# EAGLE design cbr250r_license_light (EAGLE 6.6.0)
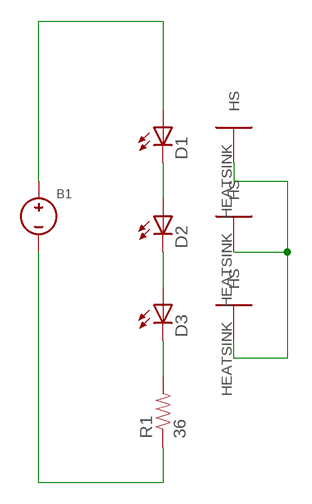
[diagram p0: schematic, sheet 1]

## Parts
B1  168_BULBLIGHT_DOWN  [168_BULB]
D1  LED_HEATSINK4-SMD  [4-SMD]
D2  LED_HEATSINK4-SMD  [4-SMD]
D3  LED_HEATSINK4-SMD  [4-SMD]
R1  36  RESISTOR2010  [R2010]

## Nets
GND: B1.2A(-) B1.2B(-) R1.1
HEATSINK: D1.HEATSINK(HS) D2.HEATSINK(HS) D3.HEATSINK(HS)
N$2: D1.CAT1(C) D1.CAT2(C) D2.ANO1(A) D2.ANO2(A)
N$3: D2.CAT1(C) D2.CAT2(C) D3.ANO1(A) D3.ANO2(A)
N$4: D3.CAT1(C) D3.CAT2(C) R1.2
VDD: B1.1A(+) B1.1B(+) D1.ANO1(A) D1.ANO2(A)

## Library data of the parts
B1 = my_parts:168_BULB
D1-D3 = my_parts:LED_HEATSINK
R1 = SparkFun-Passives:RESISTOR: Resistor Basic schematic elements and footprints for 0603, 1206, and PTH resistors.

## Board
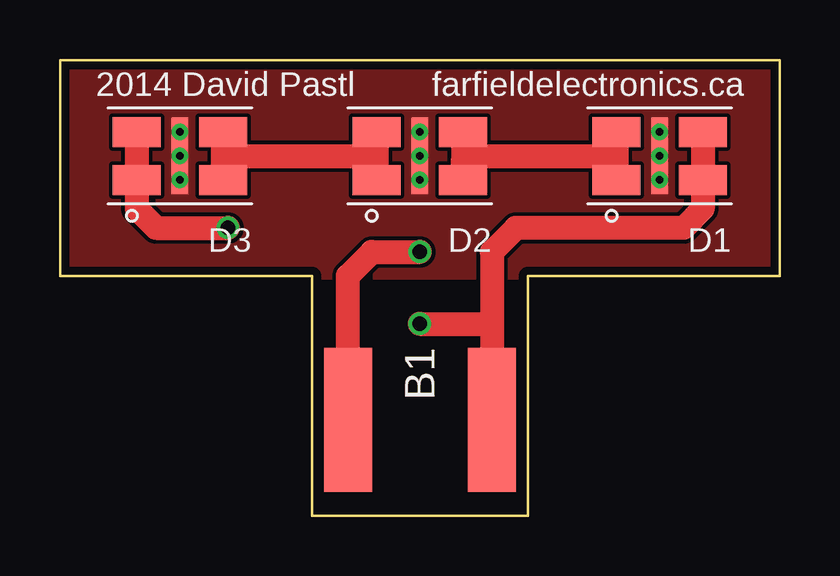
[diagram p1: board, top side]
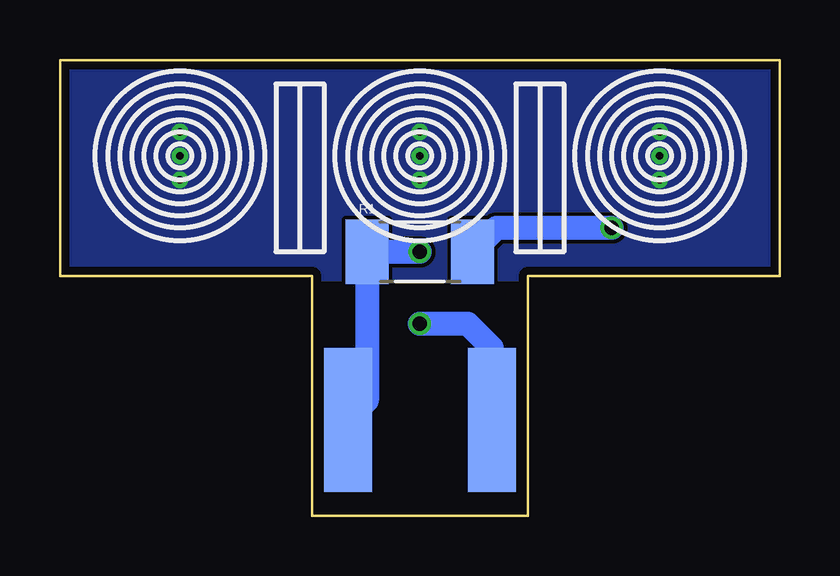
[diagram p2: board, bottom side, seen from below]

Size 30 x 19 mm. Coordinates in mm from the lower left corner, seen from the top.
Outline: 10.5,0 19.5,0 19.5,10 30,10 30,19 0,19 0,10 10.5,10 10.5,0
Copper layers (1*16): Top 0.0356mm / dielectric 1.5011mm / Bottom 0.0356mm
Design rules "LaenPCBOrder": minimum track width 6mil, minimum drill 13mil, track to track 6mil, track to pad 6mil, pad to pad 6mil, via to via 6mil, smd to smd 6mil, copper to edge 15mil, drill to drill 6mil, minimum pad ring 7mil, minimum via ring 7mil, stop-mask expansion 3mil, vias tented up to drill 0mil, thermal gap 10mil
Milling: 7 lines

### Footprints (pad centres in the part's own frame; a part is rotated, then mirrored left to right if it is on the bottom)
168_BULB = smd 2 x 6 bottom: 1A 3,3; 2A -3,3 | smd 2 x 6: 1B -3,3; 2B 3,3
4-SMD = smd 2 x 1.25: ANO1 -1.8,1; ANO2 -1.8,-1; CAT1 1.8,1; CAT2 1.8,-1 | smd 0.7 x 3.2: HEATSINK 0,0
R2010 = smd 1.8 x 2.7: 1 -2.2,0; 2 2.2,0

### Placement (x,y rotation side)
B1  15,7 180 top
D1  25,15 180 top
D2  15,15 180 top
D3  5,15 180 top
R1  15,11 0 bottom

### Tracks (layer width: path | path; a pad name or v marks a point on that pad's centre or on a via)
GND  (via drill 0.6)
  Top 1: B1.2B 12,10 13,11 v15,11
  Bottom 1: B1.2A 17.2,4.8 R1.1 v15,11
HEATSINK  (via drill 0.33)
  other vias: 5,15 15,15 25,15 5,14 5,16 15,16 15,14 25,16 25,14
  pour Bottom (no thermals): 0,19 30,19 30,10 0,10
  pour Top (no thermals): 0,19 30,19 30,10 0,10
N$2
  Top 1: D2.ANO2 D2.ANO1 16.8,14.8 17,15 23.2,15 | D1.CAT2 23.2,15 | 23.2,15 D1.CAT1
N$3
  Top 1: D2.CAT2 13.2,15 | 13.2,15 D2.CAT1 | D3.ANO1 D3.ANO2 6.8,15.2 7,15 13.2,15
N$4  (via drill 0.6)
  Top 1: D3.CAT2 D3.CAT1 3.2,12.8 4,12 v7,12
  Bottom 1: v7,12 11.8,12 R1.2
VDD  (via drill 0.6)
  Top 1: D1.ANO1 D1.ANO2 26.8,12.8 26,12 19,12 18,11 18,8 | 18,8 B1.1B | v15,8 18,8
  Bottom 1: B1.1A 12,7 13,8 v15,8

### Text on the board
tNames: 2014 David Pastl | farfieldelectronics.ca